# Altium schematic sheet USART.SchDoc
size A4; SheetNumber: 3; SheetTotal: 4
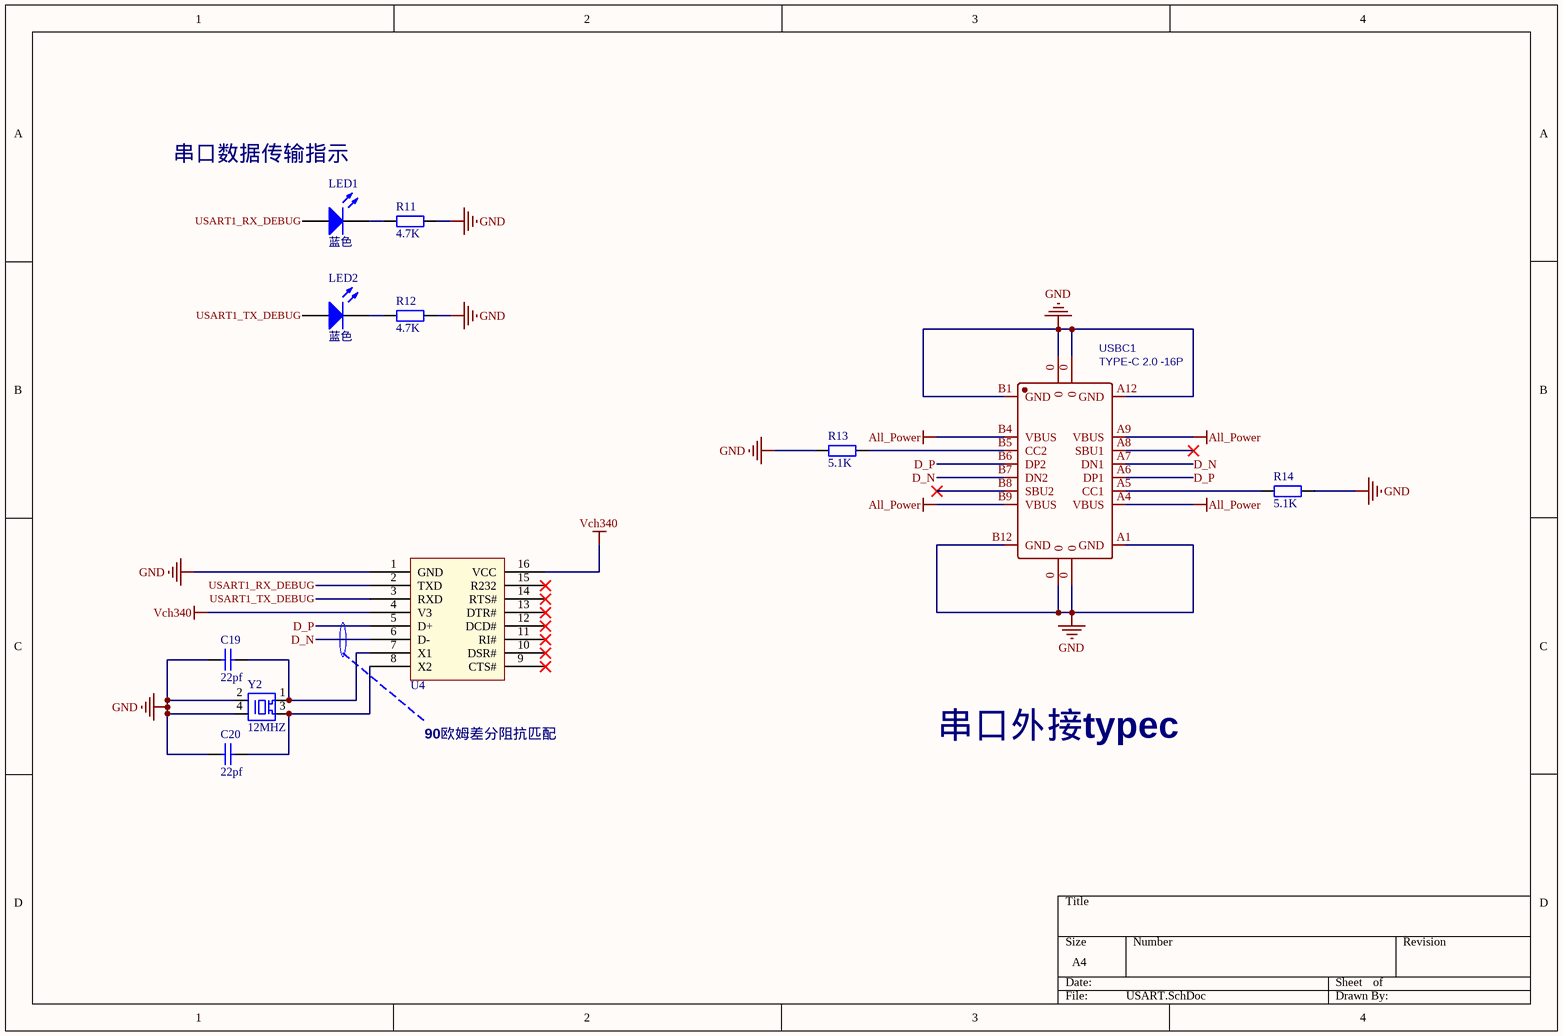
[diagram p0: USART.SchDoc]

## Parts
C19  22pf  [C0603_M]
C20  22pf  [C0603_M]
LED1  蓝色  [LED0603_B]
LED2  蓝色  [LED0603_B]
R11  4.7K  [R0603_M]
R12  4.7K  [R0603_M]
R13  5.1K  [R0603_M]
R14  5.1K  [R0603_M]
U4  CH340G  [SOP16N_N]  (value not drawn)
USBC1  TYPE-C 2.0 -16P  [USB-C-SMD_TYPE-C-USB-5]
Y2  12MHZ  [OSC 3225-4P]

## Nets
All_Power: USBC1.A4(VBUS) USBC1.A9(VBUS) USBC1.B4(VBUS) USBC1.B9(VBUS)
GND: C19.1 C20.1 R11.1 R12.1 R13.1 R14.1 U4.1(GND) USBC1.0 USBC1.A1(GND) USBC1.A12(GND) USBC1.B1(GND) USBC1.B12(GND) Y2.2(GND) Y2.4(GND)
Vch340: U4.4(V3) U4.16(VCC)
D_N: U4.6(D-) USBC1.A7(DN1) USBC1.B7(DN2)
D_P: U4.5(D+) USBC1.A6(DP1) USBC1.B6(DP2)
USART1_RX_DEBUG: LED1.1(A) U4.2(TXD)
USART1_TX_DEBUG: LED2.1(A) U4.3(RXD)
NetC19_2: C19.2 U4.7(X1) Y2.1(XTAL1)
NetC20_2: C20.2 U4.8(X2) Y2.3(XTAL3)
NetLED1_2: LED1.2(K) R11.2
NetLED2_2: LED2.2(K) R12.2
NetR13_2: R13.2 USBC1.B5(CC2)
NetR14_2: R14.2 USBC1.A5(CC1)

Not connected (* = marked no-connect by the designer): U4 9(CTS#)* 10(DSR#)* 11(RI#)* 12(DCD#)* 13(DTR#)* 14(RTS#)* 15(R232)*; USBC1 A8(SBU1)* B8(SBU2)*

## Notes on the sheet
- 串口数据传输指示
- 90欧姆差分阻抗匹配
- 串口外接typec

## Library data of the parts
C19 C20 = C: 贴片电容; BOM名称: 无极性贴片电容; 联系卖家，免费查找封装: 唯一出售店铺网址https://shop463601444.taobao.com
LED1 LED2 = LED: 贴片LED; 封装库来自淘宝卖家：黄晶宝石: 其他店铺购入均为盗版封装库，无更新权益，请立即申请退款，本店现金奖励200~1000元; BOM名称: 贴片LED
R11 R12 = R: 贴片电阻; 联系卖家，免费查找封装: 唯一出售店铺网址https://shop463601444.taobao.com; BOM名称: 贴片电阻
R13 R14 = R: 贴片电阻; 版权归属: 来自淘宝 ID：黄晶宝石; 封装库来自淘宝卖家 ID：黄晶宝石: 其他店铺购入均为盗版，不享受售后技术支持服务，请立即申请退款; BOM名称: 贴片电阻; 联系售后: https://item.taobao.com/item.htm?id=566775463719
U4 = CH340G: 技术支持，联系售后: 封装库来自淘宝卖家 ID：黄晶宝石; 唯一出售店铺网址: https://shop463601444.taobao.com
USBC1 = USB2.0 Type-C 16Pin母座: USB2.0 Type-C 母座 16Pin; BOM_Supplier: LCSC; BOM_Manufacturer Part: -; spiceSymbolName: TYPE-C 3.1 -16P_C168689
Y2 = jinzheng